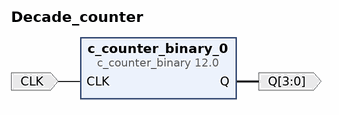
[diagram p0: block diagram of the top level]
# Vivado block design Decade_counter, xc7a35tcpg236-1, Vivado 2018.3
create_bd_design Decade_counter

create_bd_port -dir O -from 3 -to 0 -type data Q
create_bd_port -dir I -type clk CLK
set_property -dict {CONFIG.FREQ_HZ 10000000} [get_bd_ports CLK]

create_bd_cell -type ip -vlnv xilinx.com:ip:c_counter_binary:12.0 c_counter_binary_0
set_property -dict {CONFIG.Final_Count_Value 9 CONFIG.Output_Width 4 CONFIG.Restrict_Count true} [get_bd_cells c_counter_binary_0]

# ---- connections ----

connect_bd_net [get_bd_pins c_counter_binary_0/Q] [get_bd_ports Q]
connect_bd_net -net CLK_0_1 [get_bd_ports CLK] [get_bd_pins c_counter_binary_0/CLK]

validate_bd_design
save_bd_design
